# EAGLE design Keychain rev3 (EAGLE 9.6.2)
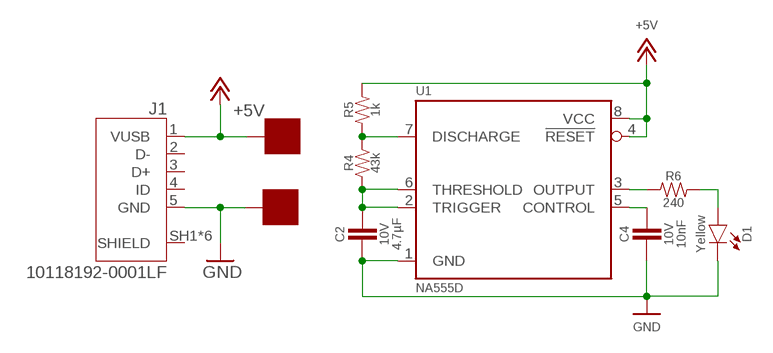
[diagram p0: schematic, sheet 1]

## Parts
5V  SOLDER_PAD  [SOLDER_PAD_XSMALL]
C2  CAPACITOR_0603_10V_4.7UF  [0603-CAP]
C4  CAPACITOR_0603_10V_10NF  [0603-CAP]
D1  LED_0603_YELLOW  [0603-LED]
GND  SOLDER_PAD  [SOLDER_PAD_XSMALL]
J1  10118192-0001LF  [AMPHENOL_10118192-0001LF]
R4  RESISTOR_0603_43K  [0603-RES]
R5  RESISTOR_0603_1K  [0603-RES]
R6  RESISTOR_0603_240  [0603-RES]
U1  NA555  [SOIC-08(NARROW,0.15")]

## Nets
+5V: 5V.P$1 J1.1(VUSB) R5.2 U1.4(!RESET) U1.8(VCC)
GND: C2.2 C4.2 D1.1(C) GND.P$1 J1.5(GND) U1.1(GND)
N$4: C2.1 R4.1 U1.2(TRIGGER) U1.6(THRESHOLD)
N$5: R4.2 R5.1 U1.7(DISCHARGE)
N$6: R6.1 U1.3(OUTPUT)
N$8: D1.2(A) R6.2
N$9: C4.1 U1.5(CONTROL)
Unconnected: J1.2(D-) J1.3(D+) J1.4(ID) J1.SH1(SHIELD) J1.SH2(SHIELD) J1.SH3(SHIELD) J1.SH4(SHIELD) J1.SH5(SHIELD) J1.SH6(SHIELD)

## Library data of the parts
5V GND = HyTechDevices:SOLDER_PAD: Solder pad used to attach wires directly to PCB
C2 = HyTechDevices:CAPACITOR_?_*: Capacitor, Non-Polarized VJ...1BC Series Datasheet <https://www.mouser.com/datasheet/2/427/vjw1bcbascomseries-1762447.pdf> Samsung Datasheet <https://www.mouser.com/datasheet/2/585/MLCC-1837944.pdf> Walsin Datasheet <https://www.mouser.com/datasheet/2/210/WTC_MLCC_General_Purpose-1534899.pdf> GRM188R61A226ME15D <https://www.mouser.com/datasheet/2/281/1/GRM188R61A226ME15_02A-1985787.pdf> GRM188R61E106MA73D <https://www.mouser.com/datasheet/2/281/1/GRM188R61E106MA73_01A-1985806.pdf> 885012006013 <https://www.mouser.com/datasheet/2/445/885012006013-1726946.pdf> 2220Y6300105KXTWS2 <https://www.mouser.com/datasheet/2/218/SMD_High_and_Std_StackiCap_P62-1825512.pdf> Yageo Class 2, X5R <https://www.mouser.com/datasheet/2/447/UPY_GPHC_X5R_4V_to_50V_26-1827097.pdf> TDK C Series <https://www.mouser.com/ProductDetail/TDK/C3216X5R1V226M160AC?qs=%2Fha2pyFadujbcx9jh7lYl%2F4NeMoXFhdc8AqVWNq4wW6M2y7zl6GzBuhgtI0ngznN> AVX Automotive MLCC <https://www.mouser.com/datasheet/2/40/AutoMLCC-777028.pdf> KEMET X7R Series <https://www.mouser.com/datasheet/2/212/KEM_C1002_X7R_SMD-1102033.pdf>; CAPACITANCE: 4.7µF; DKPN: 1276-1044-1-ND; MANUFACTURER: Samsung Electro-Mechanics; MOPN: 187-CL10A475KP8NNNC; MPN: CL10A475KP8NNNC; TOLERANCE: 10%; VOLTAGE: 10V
C4 = HyTechDevices:CAPACITOR_?_*: Capacitor, Non-Polarized VJ...1BC Series Datasheet <https://www.mouser.com/datasheet/2/427/vjw1bcbascomseries-1762447.pdf> Samsung Datasheet <https://www.mouser.com/datasheet/2/585/MLCC-1837944.pdf> Walsin Datasheet <https://www.mouser.com/datasheet/2/210/WTC_MLCC_General_Purpose-1534899.pdf> GRM188R61A226ME15D <https://www.mouser.com/datasheet/2/281/1/GRM188R61A226ME15_02A-1985787.pdf> GRM188R61E106MA73D <https://www.mouser.com/datasheet/2/281/1/GRM188R61E106MA73_01A-1985806.pdf> 885012006013 <https://www.mouser.com/datasheet/2/445/885012006013-1726946.pdf> 2220Y6300105KXTWS2 <https://www.mouser.com/datasheet/2/218/SMD_High_and_Std_StackiCap_P62-1825512.pdf> Yageo Class 2, X5R <https://www.mouser.com/datasheet/2/447/UPY_GPHC_X5R_4V_to_50V_26-1827097.pdf> TDK C Series <https://www.mouser.com/ProductDetail/TDK/C3216X5R1V226M160AC?qs=%2Fha2pyFadujbcx9jh7lYl%2F4NeMoXFhdc8AqVWNq4wW6M2y7zl6GzBuhgtI0ngznN> AVX Automotive MLCC <https://www.mouser.com/datasheet/2/40/AutoMLCC-777028.pdf> KEMET X7R Series <https://www.mouser.com/datasheet/2/212/KEM_C1002_X7R_SMD-1102033.pdf>; CAPACITANCE: 10nF; DKPN: 311-4054-1-ND; MANUFACTURER: Yageo; MOPN: 603-CC603KRX7R6BB103; MPN: CC0603KRX7R6BB103; TOLERANCE: 10%; VOLTAGE: 10V
D1 = HyTechDevices:LED_?_*: LED Blue <https://www.mouser.com/datasheet/2/216/APT1608VBC_D-246010.pdf> Green <https://www.mouser.com/datasheet/2/216/APT1608ZGCK-1173388.pdf> Orange <https://www.mouser.com/datasheet/2/216/APT1608SECK-6197.pdf> Red <https://www.mouser.com/datasheet/2/216/APT1608SECK-J3-PRV-1173336.pdf> White <https://www.mouser.com/datasheet/2/50/SM0603UWC-880813.pdf> Yellow <https://www.mouser.com/datasheet/2/216/APT1608SYCK-J3-PRV-1173311.pdf>; COLOR: Yellow; DKPN: 754-1788-1-ND; MANUFACTURER: Kingbright; MOPN: 604-APT1608SYCK/J3-PRV; MPN: APT1608SYCK/J3-PRV
J1 = HyTechDevices:10118192-0001LF: Single Port 5 Contact Horizontal Right Angle Shielded Micro B USB 2.0 Connector; AVAILABILITY: Unavailable; DESCRIPTION: USB - micro B USB 2.0 Receptacle Connector 5 Position Surface Mount, Right Angle; MF: Amphenol ICC; MP: 10118192-0001LF; PACKAGE: None; PRICE: None
R4 = HyTechDevices:RESISTOR_?_*: Resistor PWR163 Series <https://www.mouser.com/datasheet/2/54/pwr163-777985.pdf> AC Series <https://www.mouser.com/datasheet/2/447/Yageo_PYu_AC_51_RoHS_L_7_1714230-1874691.pdf> PU Series <https://www.mouser.com/datasheet/2/447/PYu-PU_51_RoHS_L_6-1504619.pdf> ERA Series <https://www.mouser.com/datasheet/2/315/AOA0000C307-1149632.pdf> PWR263 Series <https://www.mouser.com/datasheet/2/54/pwr263s_35-778069.pdf> RC Series <https://www.mouser.com/datasheet/2/447/Yageo_03_18_2021_PYu_RC_Group_51_RoHS_L_11-2199992.pdf> ERJ PB3, PB6 Series <https://www.mouser.com/datasheet/2/315/AOA0000C328-1530132.pdf> ERJ PA2, P03, PA3, P06, P08, P14 Series <https://www.mouser.com/datasheet/2/315/AOA0000C331-1141874.pdf>; DKPN: 311-43.0KHRCT-ND; MANUFACTURER: Yageo; MOPN: 603-RC0603FR-0743KL; MPN: RC0603FR-0743KL; POWER: 0.1W; RESISTANCE: 43k; TOLERANCE: 1%; VOLTAGE_CONTINUOUS: 65.57V; VOLTAGE_MAX: 75V
R5 = HyTechDevices:RESISTOR_?_*: Resistor PWR163 Series <https://www.mouser.com/datasheet/2/54/pwr163-777985.pdf> AC Series <https://www.mouser.com/datasheet/2/447/Yageo_PYu_AC_51_RoHS_L_7_1714230-1874691.pdf> PU Series <https://www.mouser.com/datasheet/2/447/PYu-PU_51_RoHS_L_6-1504619.pdf> ERA Series <https://www.mouser.com/datasheet/2/315/AOA0000C307-1149632.pdf> PWR263 Series <https://www.mouser.com/datasheet/2/54/pwr263s_35-778069.pdf> RC Series <https://www.mouser.com/datasheet/2/447/Yageo_03_18_2021_PYu_RC_Group_51_RoHS_L_11-2199992.pdf> ERJ PB3, PB6 Series <https://www.mouser.com/datasheet/2/315/AOA0000C328-1530132.pdf> ERJ PA2, P03, PA3, P06, P08, P14 Series <https://www.mouser.com/datasheet/2/315/AOA0000C331-1141874.pdf>; DKPN: 311-1.00KHRCT-ND; MANUFACTURER: Yageo; MOPN: 603-RC0603FR-071KL; MPN: RC0603FR-071KL; POWER: 0.1W; RESISTANCE: 1k; TOLERANCE: 1%; VOLTAGE_CONTINUOUS: 10.00V; VOLTAGE_MAX: 75V
R6 = HyTechDevices:RESISTOR_?_*: Resistor PWR163 Series <https://www.mouser.com/datasheet/2/54/pwr163-777985.pdf> AC Series <https://www.mouser.com/datasheet/2/447/Yageo_PYu_AC_51_RoHS_L_7_1714230-1874691.pdf> PU Series <https://www.mouser.com/datasheet/2/447/PYu-PU_51_RoHS_L_6-1504619.pdf> ERA Series <https://www.mouser.com/datasheet/2/315/AOA0000C307-1149632.pdf> PWR263 Series <https://www.mouser.com/datasheet/2/54/pwr263s_35-778069.pdf> RC Series <https://www.mouser.com/datasheet/2/447/Yageo_03_18_2021_PYu_RC_Group_51_RoHS_L_11-2199992.pdf> ERJ PB3, PB6 Series <https://www.mouser.com/datasheet/2/315/AOA0000C328-1530132.pdf> ERJ PA2, P03, PA3, P06, P08, P14 Series <https://www.mouser.com/datasheet/2/315/AOA0000C331-1141874.pdf>; DKPN: 311-240HRCT-ND; MANUFACTURER: Yageo; MOPN: 603-RC0603FR-07240RL; MPN: RC0603FR-07240RL; POWER: 0.1W; RESISTANCE: 240; TOLERANCE: 1%; VOLTAGE_CONTINUOUS: 4.90V; VOLTAGE_MAX: 75V
U1 = HyTechDevices:*555: **555 Precision Timer NA555, NE555, SA555, SE555 <https://www.ti.com/lit/ds/symlink/na555.pdf> LM555 <https://www.ti.com/lit/ds/symlink/lm555.pdf>; DKPN: NA555D-ND; MANUFACTURER: Texas Instruments; MOPN: 595-NA555D; MPN: NA555D

## Board
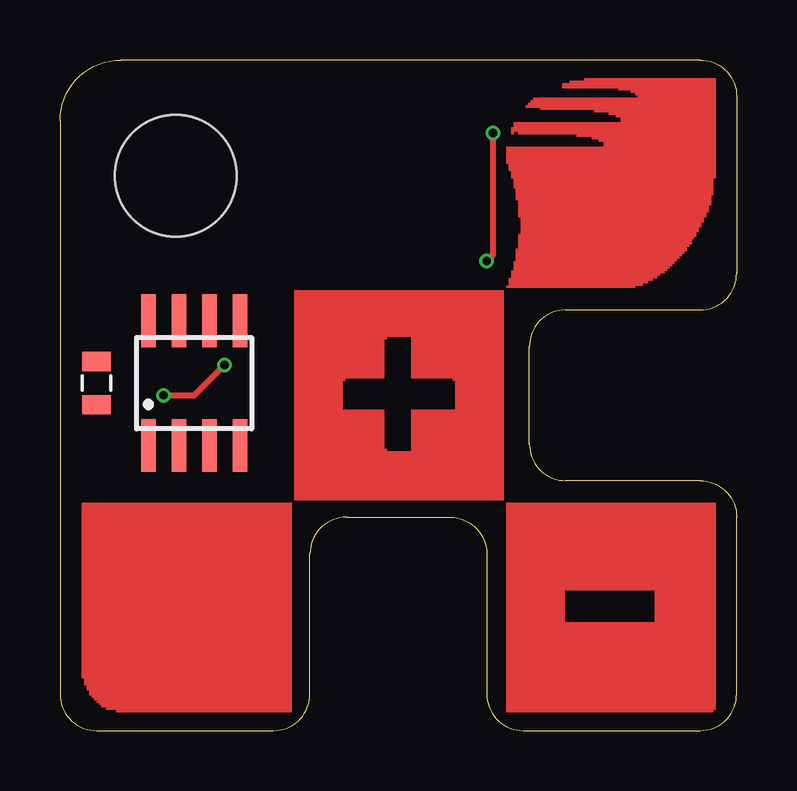
[diagram p1: board, top side]
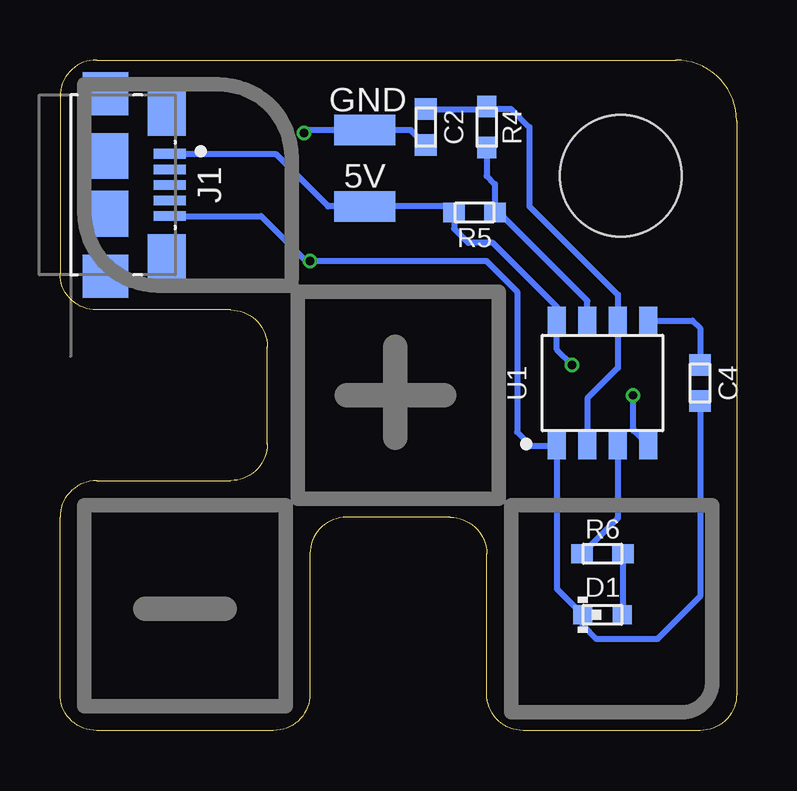
[diagram p2: board, bottom side, seen from below]

Size 28.19 x 27.94 mm. Coordinates in mm from the lower left corner, seen from the top.
Outline: 1.52,0 8.89,0 arc90 10.41,1.52 10.41,7.37 arc-90 11.94,8.89 16.26,8.89 arc-90 17.78,7.37 17.78,1.52 arc90 19.3,0 26.67,0 arc90 28.19,1.52 28.19,8.89 arc90 26.67,10.41 21.08,10.41 arc-90 19.56,11.94 19.56,16 arc-90 21.08,17.53 26.67,17.53 arc90 28.19,19.05 28.19,26.42 arc90 26.67,27.94 2.54,27.94 arc90 0,25.4 0,1.52 arc90 1.52,0
Copper layers (1*16): Top 0.035559375mm / dielectric 1.6mm / Bottom 0.035559375mm
Design rules "DRC Oshpark": minimum track width 6mil, minimum drill 10mil, track to track 6mil, track to pad 6mil, pad to pad 6mil, via to via 6mil, smd to smd 6mil, copper to edge 15mil, drill to drill 6mil, minimum pad ring 5mil, minimum via ring 5mil, stop-mask expansion 2.5mil, vias tented up to drill 30mil, thermal gap 10mil
Holes 5.08 mm at 4.83,23.11

### Footprints (pad centres in the part's own frame; a part is rotated, then mirrored left to right if it is on the bottom)
SOLDER_PAD_XSMALL = smd 2.54 x 1.27: P$1 0,0
0603-CAP = smd 0.9 x 0.9: 1 -0.75,0; 2 0.75,0
0603-LED = smd 0.8 x 0.8: 1 -0.825,0; 2 0.825,0
0805@1 = smd 0.8 x 1.2: 1 -0.9,0; 2 0.9,0
SOIC-08 = smd 0.6 x 2.2: 1 -1.905,-2.6; 2 -0.635,-2.6; 3 0.635,-2.6; 4 1.905,-2.6; 5 1.905,2.6; 6 0.635,2.6; 7 -0.635,2.6; 8 -1.905,2.6
AMPHENOL_10118192-0001LF = smd 0.4 x 1.35: 1 -1.3,0; 2 -0.65,0; 3 0,0; 4 0.65,0; 5 1.3,0 | smd 2.1 x 1.6: SH1 -3.1,-0.125; SH2 3.1,-0.125 | smd 1.8 x 1.9: SH3 -3.8,-2.675; SH6 3.8,-2.675 | smd 1.9 x 1.9: SH4 -1.2,-2.675; SH5 1.2,-2.675
0603-RES = smd 0.9 x 0.8: 1 -0.85,0; 2 0.85,0
SOIC-08(NARROW,0.15") = smd 0.762 x 1.143: 1 -1.905,-2.603; 2 -0.635,-2.603; 3 0.635,-2.603; 4 1.905,-2.603; 5 1.905,2.603; 6 0.635,2.603; 7 -0.635,2.603; 8 -1.905,2.603

### Placement (x,y rotation side)
5V  15.49,21.84 0 bottom
C2  12.95,25.15 270 bottom
C4  1.52,14.48 270 bottom
D1  5.59,4.83 0 bottom
E$1  [0805@1]  1.52,14.48 90 top
E$2  [SOIC-08]  5.59,14.48 0 top
GND  15.49,25.02 0 bottom
J1  23.62,22.73 270 bottom
R4  10.41,25.15 270 bottom
R5  10.92,21.59 180 bottom
R6  5.59,7.37 0 bottom
U1  5.59,14.48 0 bottom

### Tracks (layer width: path | path; a pad name or v marks a point on that pad's centre or on a via)
+5V  (via drill 0.35)
  Top 0.254: v4.32,13.97 5.59,13.97 v6.86,15.24
  Bottom 0.254: J1.1 19.21,24.03 17.02,21.84 5V.P$1 12.03,21.84 R5.2 11.77,20.92 11.18,20.32 10.16,20.32 7.49,17.65 U1.8 7.49,15.88 v6.86,15.24 | U1.4 4.29,12.48 4.29,12.56 4.32,12.59 v4.32,13.97
GND  (via drill 0.35)
  Top 0.254: v18.03,24.89 18.03,19.81 v17.78,19.56
  Bottom 0.254: J1.5 19.81,21.43 17.94,19.56 v17.78,19.56 10.41,19.56 9.14,18.29 9.14,12.45 8.57,11.88 U1.1 7.49,5.91 D1.1 6.41,4.38 5.84,3.81 3.3,3.81 1.52,5.59 C4.2 | v18.03,24.89 17.91,25.02 GND.P$1 13.58,25.02 C2.2
N$4
  Bottom 0.254: U1.2 6.22,13.84 4.95,15.11 U1.6 4.95,18.16 8.64,21.84 8.64,25.15 9.4,25.91 10.33,25.91 R4.1 10.51,25.9 C2.1
N$5
  Bottom 0.254: R4.2 10.41,23.11 10.07,22.77 R5.1 9.91,21.59 6.22,17.91 U1.7
N$6
  Bottom 0.254: U1.3 4.95,8.85 R6.1
N$8
  Bottom 0.254: R6.2 4.74,4.85 D1.2
N$9
  Bottom 0.254: U1.5 1.84,17.08 1.52,16.76 C4.1
(copper drawn outside any net)
  shapes: Top area x405

### Text on the board
tDocu: HyTech / Racing